# Altium schematic sheet Shutdown_Circuit_Sch.SchDoc
size 469 x 240 mm; SheetNumber: 1; SheetTotal: 1
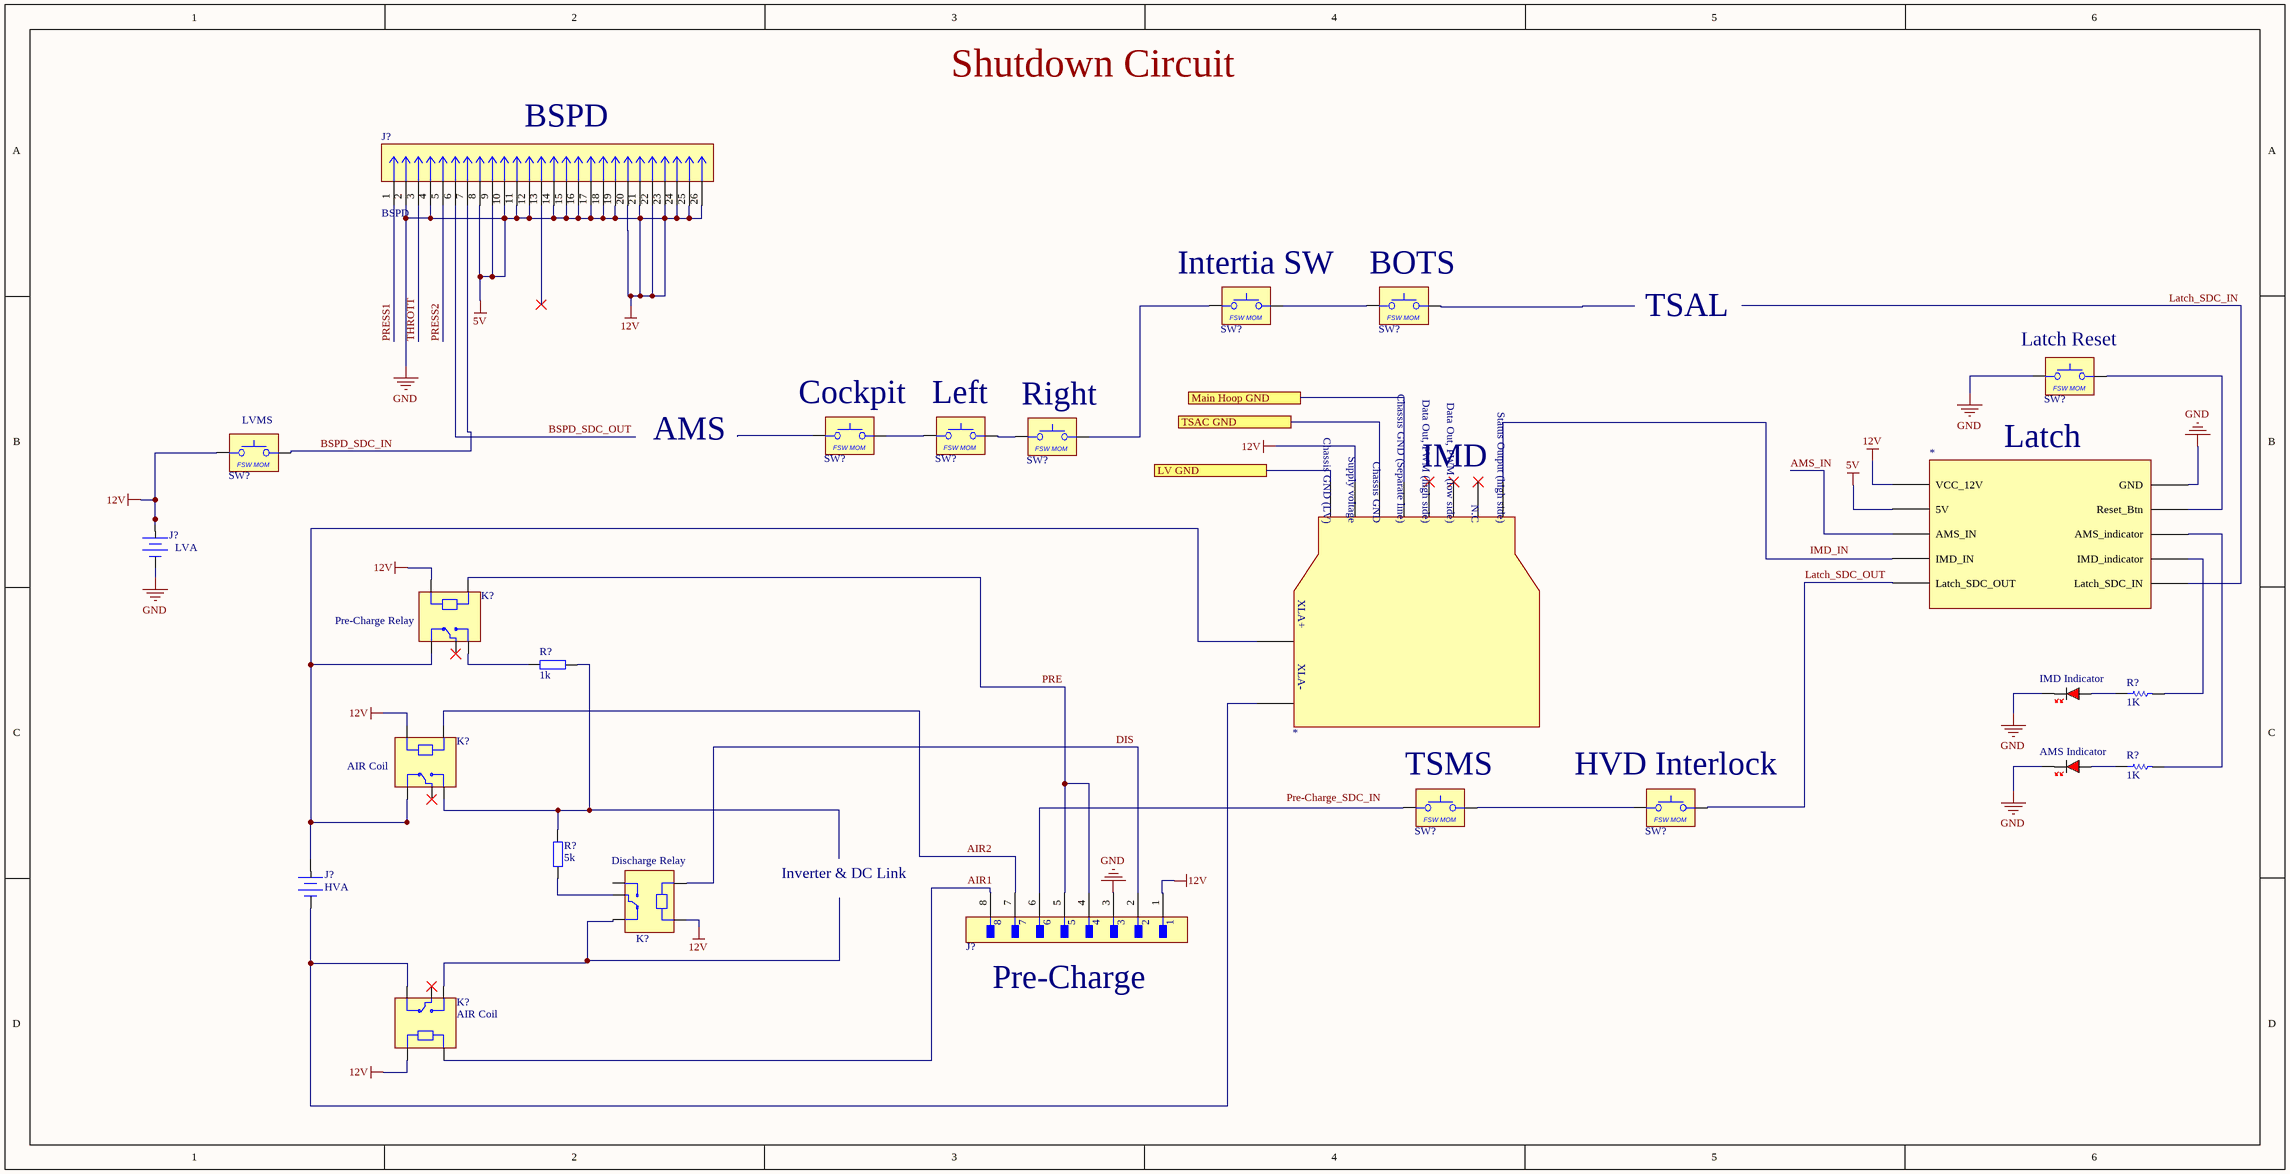
[diagram p0: Shutdown_Circuit_Sch.SchDoc]

## Parts
(Parts that share a designator on the sheet are numbered #1, #2 ... from top to bottom, then left to right.)
*#1  Component_1  (value not drawn)
*#2  Component_1  (value not drawn)
D?#1  IMD Indicator  [LED_0603_RED]
D?#2  AMS Indicator  [LED_0603_RED]
J?#1  BSPD  [CONN26_KFMS-RC_SUL]
J?#2  LVA  [2998TR]
J?#3  HVA  [2998TR]
J?#4  Pre-Charge  [FP-S8B-XH-A-1_LF_SN-MFG]  (value not drawn)
K?#1  Pre-Charge Relay  [RELAY_SRD-05VDC-SL-C]
K?#2  AIR Coil  [RELAY_SRD-05VDC-SL-C]
K?#3  Discharge Relay  [RELAY_SRD-05VDC-SL-C]
K?#4  AIR Coil  [RELAY_SRD-05VDC-SL-C]
R?#1  1k  [RES_0805]
R?#2  value 1K  (hidden comment: Resistor)
R?#3  value 1K  (hidden comment: Resistor)
R?#4  5k  [RES_0805]
SW?#1  Intertia SW  [FOOTSWITCH_MOM]
SW?#2  BOTS  [FOOTSWITCH_MOM]
SW?#3  Latch Reset  [FOOTSWITCH_MOM]
SW?#4  Cockpit  [FOOTSWITCH_MOM]
SW?#5  Left  [FOOTSWITCH_MOM]
SW?#6  Right  [FOOTSWITCH_MOM]
SW?#7  LVMS  [FOOTSWITCH_MOM]
SW?#8  TSMS  [FOOTSWITCH_MOM]
SW?#9  HVD Interlock  [FOOTSWITCH_MOM]

## Ports
LV GND, Main Hoop GND, TSAC GND

## Nets
12V: *#1.11(VCC_12V) *#1.12(5V) *#1.16(GND) *#2.7 D?#1.K D?#2.K J?#1.2 J?#1.4 J?#1.8 J?#1.9 J?#1.10 J?#1.11 J?#1.12 J?#1.14 J?#1.15 J?#1.16 J?#1.17 J?#1.18 J?#1.19 J?#1.20 J?#1.21 J?#1.22 J?#1.23 J?#1.24 J?#1.25 J?#1.26 J?#2.A J?#2.K J?#4.1 J?#4.3 K?#1.A2 K?#2.A2 K?#3.A2 K?#4.A2 SW?#3.1 SW?#7.1  [also labelled 5V, GND]
AIR1: J?#4.8 K?#4.A1
AIR2: J?#4.7 K?#2.A1
AMS_IN: *#1.13(AMS_IN)
BSPD_SDC_IN: J?#1.7 SW?#7.2
BSPD_SDC_OUT: J?#1.6
DIS: J?#4.2 K?#3.A1
Latch_SDC_IN: *#1.20(Latch_SDC_IN)
Latch_SDC_OUT: *#1.15(Latch_SDC_OUT) SW?#9.2
LV GND: *#2.8 ; port LV GND
Main Hoop GND: *#2.5 ; port Main Hoop GND
PRE: J?#4.4 J?#4.5 K?#1.A1
PRESS1: J?#1.1
PRESS2: J?#1.5
THROTT: J?#1.3
TSAC GND: *#2.6 ; port TSAC GND
Net*#1_14: *#1.14(IMD_IN) *#2.1
Net*#1_17: *#1.17(Reset_Btn) SW?#3.2
Net*#1_18: *#1.18(AMS_indicator) R?#3.2
Net*#1_19: *#1.19(IMD_indicator) R?#2.2
Net*#2_9: *#2.9 J?#3.K K?#4.NC
Net*#2_10: *#2.10 J?#3.A K?#1.NC K?#2.NC
NetD?#1_A: D?#1.A R?#2.1
NetD?#2_A: D?#2.A R?#3.1
NetJ?#4_6: J?#4.6 SW?#8.1
NetK?#1_NO: K?#1.NO R?#1.2
NetK?#2_NO: K?#2.NO R?#1.1 R?#4.1
NetK?#3_COM: K?#3.COM R?#4.2
NetK?#3_NC: K?#3.NC K?#4.NO
NetSW?#1_1: SW?#1.1 SW?#6.2
NetSW?#1_2: SW?#1.2 SW?#2.1
NetSW?#4_2: SW?#4.2 SW?#5.1
NetSW?#5_2: SW?#5.2 SW?#6.1
NetSW?#8_2: SW?#8.2 SW?#9.1

Not connected (* = marked no-connect by the designer): *#2 2* 3* 4*; J?#1 13*; K?#1 COM*; K?#2 COM*; K?#3 NO; K?#4 COM*; SW?#2 2; SW?#4 1

## Notes on the sheet
- Shutdown Circuit
- (near J?#1) BSPD
- TSAL
- AMS
- Latch
- (near *#2) IMD
- Inverter & DC Link
- (near J?#4) Pre-Charge
- Labels drawn without touching a wire or pin: IMD_IN, Pre-Charge_SDC_IN
- (in symbol Component_1) Chassis GND (LV); Supply voltage; Chassis GND; Chassis GND (Separate line); Data Out, PWM (high side); Data Out, PWM (low side); N.C; Status Output (high side); XLA+; XLA-
- (in symbol FOOTSWITCH_MOM) FSW MOM

## Library data of the parts
D?#1 D?#2 = LED_0603_RED: LED 0603 RED SMD
J?#1 = NPPC132KFMS-RC: 26 Position Header Connector 0.100 (2.54mm) Surface Mount Gold; MF: Sullins Connector; SnapEDA_Link: https://www.snapeda.com/parts/NPPC132KFMS-RC/Sullins/view-part/?ref=snap; Package: None; Value: *; MP: NPPC132KFMS-RC; Check_prices: https://www.snapeda.com/parts/NPPC132KFMS-RC/Sullins/view-part/?ref=eda
J?#2 J?#3 = 2998TR: Coin Cell Battery Holder 6.8mm; Manufacturer: Keystone Electronics; Manufacturer Part Number: 2998TR
J?#4 = CMP-17439-000621-1: CONN HEADER R/A 8POS 2.5MM; Voltage Rating: 250V; Number of Positions: 8; Flammability Rating: UL94 V-0; Fastening Type: Detent; Series: XH; Connector Type: Header; Min Operating Temperature: -25°C; Lead Free: Lead Free; Number of Rows: 1; Packaging: Bulk; Contact Shape: Square; Contact Type: Male Pin; Mount: Through Hole; Contact Finish - Mating: TIN; Insulation Material: Nylon; Insulation Color: Natural; Contact Material: Brass; Max Operating Temperature: 85°C; Termination: Press-Fit
K?#1-K?#4 = SRD-05VDC-SL-C: 5V Trigger Relay Module For Arduino And Raspberry Pi 5V Trigger Relay Module For Arduino And Raspberry Pi; MF: Songle Relay; Check_prices: https://www.snapeda.com/parts/SRD-05VDC-SL-C/Songle+Relay/view-part/?ref=eda; Value: *; Availability: Not in stock; Price: None; Package: NON STANDARD-5 Songle Relay; MP: SRD-05VDC-SL-C; SnapEDA_Link: https://www.snapeda.com/parts/SRD-05VDC-SL-C/Songle+Relay/view-part/?ref=snap
R?#1 R?#4 = RES_0805: Resistor SMD 0805; Manufacturer: *; Manufacturer Part Number: *; Distributor Link: *; LCSC: *
R?#2 R?#3 = Resistor: TC1: 0; SimulationGenericComponent: True; TC2: 0
SW?#1-SW?#9 = FOOTSWITCH_MOM: Header 2.54mm THT for Momentary SPST Footswitch